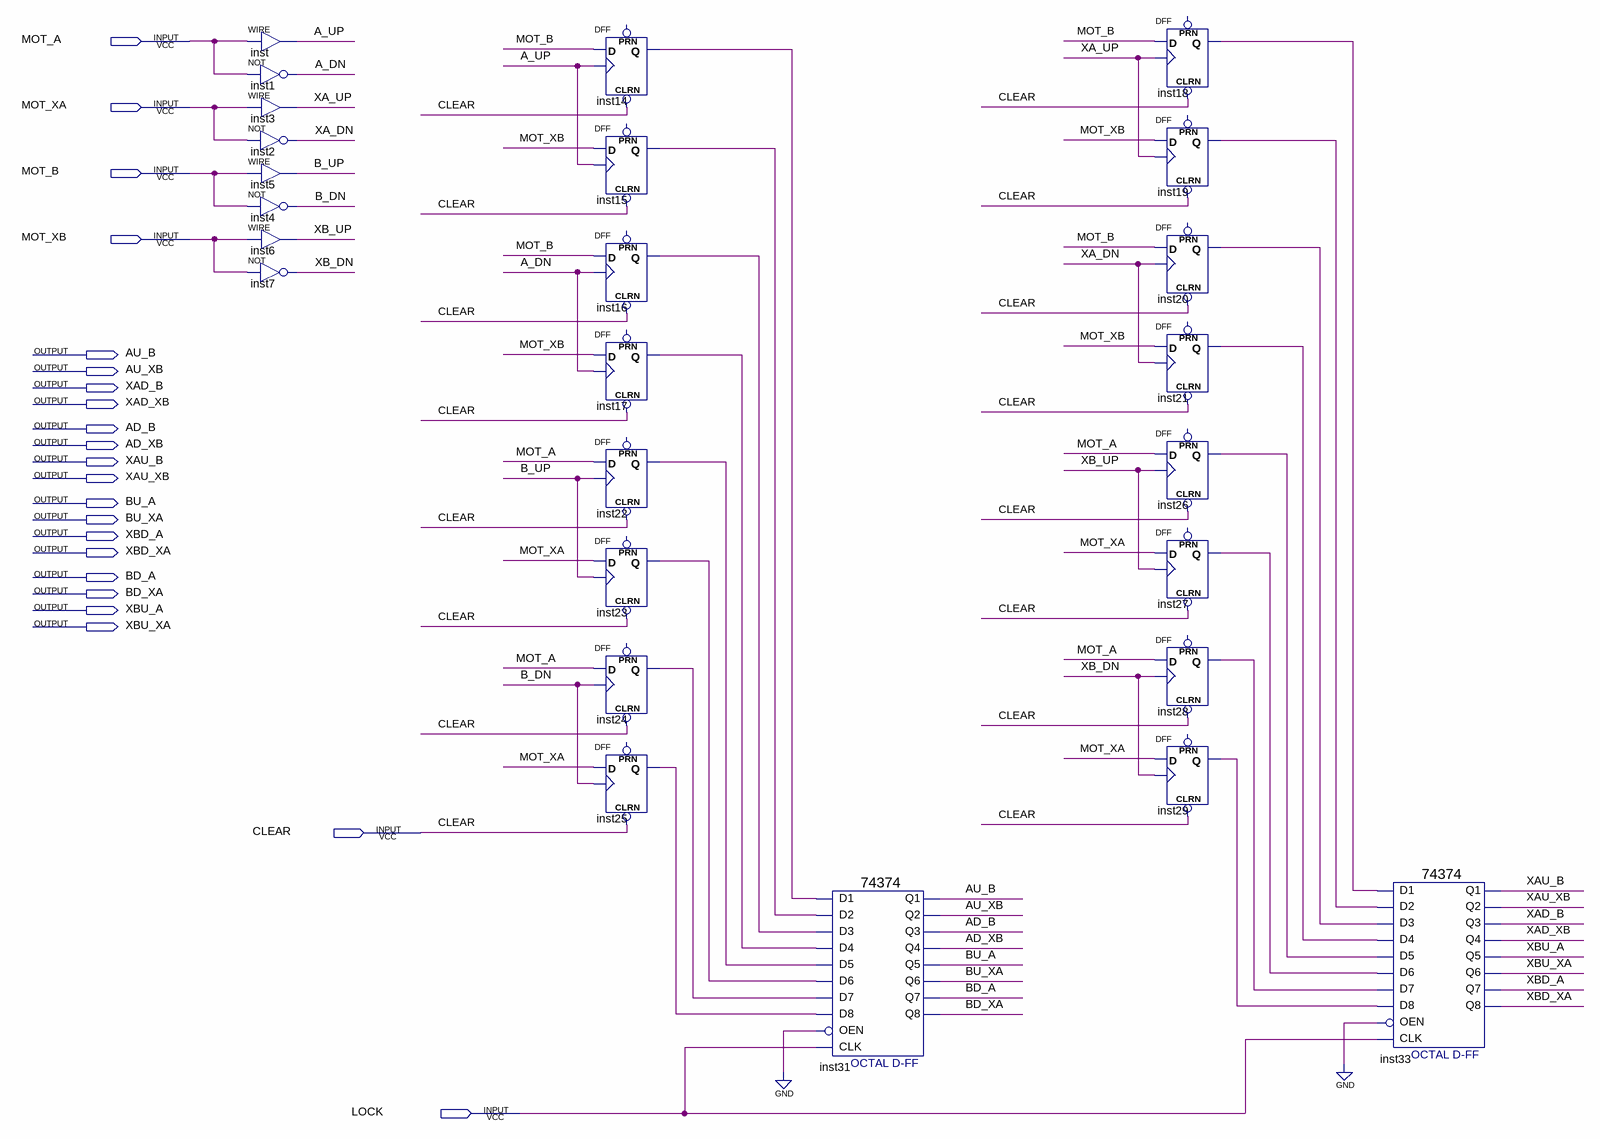
[diagram p0: schematic sheet]
// Quartus schematic Mot_Phase.bdf as structural Verilog: 26 symbols, 22 pins
module Mot_Phase (
  input  MOT_A,
  input  MOT_XA,
  input  MOT_B,
  input  MOT_XB,
  input  CLEAR,
  input  LOCK,
  output AU_B,
  output AU_XB,
  output XAD_B,
  output XAD_XB,
  output AD_B,
  output AD_XB,
  output XAU_B,
  output XAU_XB,
  output BU_A,
  output BU_XA,
  output XBD_A,
  output XBD_XA,
  output BD_A,
  output BD_XA,
  output XBU_A,
  output XBU_XA
);

  wire A_DN, A_UP, B_DN, B_UP, inst14_q, inst15_q, inst16_q, inst17_q, inst18_q, inst19_q, inst20_q,
       inst21_q, inst22_q, inst23_q, inst24_q, inst25_q, inst26_q, inst27_q, inst28_q, inst29_q, XA_DN,
       XA_UP, XB_DN, XB_UP;

  assign A_UP = MOT_A;  // WIRE inst
  not inst1 (A_DN, MOT_A);
  assign XA_UP = MOT_XA;  // WIRE inst3
  not inst2 (XA_DN, MOT_XA);
  assign B_UP = MOT_B;  // WIRE inst5
  not inst4 (B_DN, MOT_B);
  assign XB_UP = MOT_XB;  // WIRE inst6
  not inst7 (XB_DN, MOT_XB);
  DFF inst14 (.CLRN(CLEAR), .CLK(A_UP), .D(MOT_B), .Q(inst14_q));  // open: PRN
  DFF inst15 (.CLRN(CLEAR), .CLK(A_UP), .D(MOT_XB), .Q(inst15_q));  // open: PRN
  DFF inst16 (.CLRN(CLEAR), .CLK(A_DN), .D(MOT_B), .Q(inst16_q));  // open: PRN
  DFF inst17 (.CLRN(CLEAR), .CLK(A_DN), .D(MOT_XB), .Q(inst17_q));  // open: PRN
  DFF inst22 (.CLRN(CLEAR), .CLK(B_UP), .D(MOT_A), .Q(inst22_q));  // open: PRN
  DFF inst23 (.CLRN(CLEAR), .CLK(B_UP), .D(MOT_XA), .Q(inst23_q));  // open: PRN
  DFF inst24 (.CLRN(CLEAR), .CLK(B_DN), .D(MOT_A), .Q(inst24_q));  // open: PRN
  DFF inst25 (.CLRN(CLEAR), .CLK(B_DN), .D(MOT_XA), .Q(inst25_q));  // open: PRN
  \74374  inst31 (
    .D1(inst14_q), .D2(inst15_q), .D3(inst16_q), .D4(inst17_q), .D6(inst23_q), .D5(inst22_q), .OEN(1'b0),
    .D8(inst25_q), .D7(inst24_q), .CLK(LOCK), .Q2(AU_XB), .Q3(AD_B), .Q5(BU_A), .Q4(AD_XB), .Q6(BU_XA),
    .Q7(BD_A), .Q8(BD_XA), .Q1(AU_B));
  DFF inst18 (.CLRN(CLEAR), .CLK(XA_UP), .D(MOT_B), .Q(inst18_q));  // open: PRN
  DFF inst19 (.CLRN(CLEAR), .CLK(XA_UP), .D(MOT_XB), .Q(inst19_q));  // open: PRN
  DFF inst20 (.CLRN(CLEAR), .CLK(XA_DN), .D(MOT_B), .Q(inst20_q));  // open: PRN
  DFF inst21 (.CLRN(CLEAR), .CLK(XA_DN), .D(MOT_XB), .Q(inst21_q));  // open: PRN
  DFF inst26 (.CLRN(CLEAR), .CLK(XB_UP), .D(MOT_A), .Q(inst26_q));  // open: PRN
  DFF inst27 (.CLRN(CLEAR), .CLK(XB_UP), .D(MOT_XA), .Q(inst27_q));  // open: PRN
  DFF inst28 (.CLRN(CLEAR), .CLK(XB_DN), .D(MOT_A), .Q(inst28_q));  // open: PRN
  DFF inst29 (.CLRN(CLEAR), .CLK(XB_DN), .D(MOT_XA), .Q(inst29_q));  // open: PRN
  \74374  inst33 (
    .D1(inst18_q), .D2(inst19_q), .D3(inst20_q), .D4(inst21_q), .D6(inst27_q), .D5(inst26_q), .OEN(1'b0),
    .D8(inst29_q), .D7(inst28_q), .CLK(LOCK), .Q2(XAU_XB), .Q3(XAD_B), .Q5(XBU_A), .Q4(XAD_XB), .Q6(XBU_XA),
    .Q7(XBD_A), .Q8(XBD_XA), .Q1(XAU_B));
endmodule
